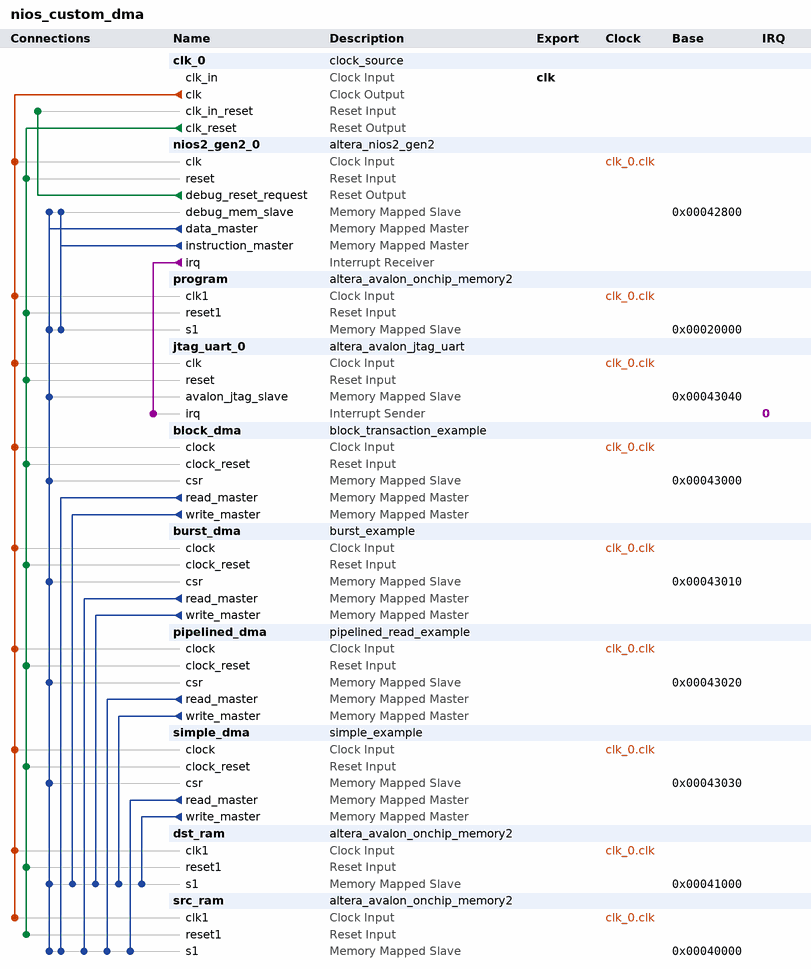
[diagram p0: system contents]
# Platform Designer (Qsys) system nios_custom_dma, MAX 10 10M50DAF484C6GES
# Parameters at their usual value, and those the tool derives, are not listed.
package require -exact qsys 22.1
create_system nios_custom_dma
set_project_property DEVICE_FAMILY {MAX 10}
set_project_property DEVICE 10M50DAF484C6GES

add_instance clk_0 clock_source 22.1
set_instance_parameter_value clk_0 clockFrequency 50000000

add_instance nios2_gen2_0 altera_nios2_gen2 22.1
set_instance_parameter_value nios2_gen2_0 dcache_size 2048
set_instance_parameter_value nios2_gen2_0 exceptionSlave program.s1
set_instance_parameter_value nios2_gen2_0 icache_size 4096
set_instance_parameter_value nios2_gen2_0 impl Fast
set_instance_parameter_value nios2_gen2_0 resetSlave program.s1

add_instance program altera_avalon_onchip_memory2 22.1
set_instance_parameter_value program dataWidth 32
set_instance_parameter_value program dualPort false
set_instance_parameter_value program initMemContent true
set_instance_parameter_value program initializationFileName onchip_mem.hex
set_instance_parameter_value program memorySize 81920

add_instance jtag_uart_0 altera_avalon_jtag_uart 22.1
set_instance_parameter_value jtag_uart_0 simInteractiveOptions NO_INTERACTIVE_WINDOWS

add_instance block_dma block_transaction_example 1.2

add_instance burst_dma burst_example 1.2

add_instance pipelined_dma pipelined_read_example 1.2

add_instance simple_dma simple_example 1.2

add_instance dst_ram altera_avalon_onchip_memory2 22.1
set_instance_parameter_value dst_ram dataWidth 32
set_instance_parameter_value dst_ram dualPort false
set_instance_parameter_value dst_ram initMemContent true
set_instance_parameter_value dst_ram initializationFileName onchip_mem.hex
set_instance_parameter_value dst_ram memorySize 4096

add_instance src_ram altera_avalon_onchip_memory2 22.1
set_instance_parameter_value src_ram dataWidth 32
set_instance_parameter_value src_ram dualPort false
set_instance_parameter_value src_ram initMemContent true
set_instance_parameter_value src_ram initializationFileName onchip_mem.hex
set_instance_parameter_value src_ram memorySize 4096

# connections
add_connection clk_0.clk block_dma.clock clock
add_connection clk_0.clk burst_dma.clock clock
add_connection clk_0.clk dst_ram.clk1 clock
add_connection clk_0.clk jtag_uart_0.clk clock
add_connection clk_0.clk nios2_gen2_0.clk clock
add_connection clk_0.clk pipelined_dma.clock clock
add_connection clk_0.clk program.clk1 clock
add_connection clk_0.clk simple_dma.clock clock
add_connection clk_0.clk src_ram.clk1 clock
add_connection clk_0.clk_reset block_dma.clock_reset reset
add_connection clk_0.clk_reset burst_dma.clock_reset reset
add_connection clk_0.clk_reset dst_ram.reset1 reset
add_connection clk_0.clk_reset jtag_uart_0.reset reset
add_connection clk_0.clk_reset nios2_gen2_0.reset reset
add_connection clk_0.clk_reset pipelined_dma.clock_reset reset
add_connection clk_0.clk_reset program.reset1 reset
add_connection clk_0.clk_reset simple_dma.clock_reset reset
add_connection clk_0.clk_reset src_ram.reset1 reset
add_connection nios2_gen2_0.debug_reset_request clk_0.clk_in_reset reset
add_connection block_dma.read_master src_ram.s1 avalon
set_connection_parameter_value block_dma.read_master/src_ram.s1 baseAddress 0x00040000
add_connection block_dma.write_master dst_ram.s1 avalon
set_connection_parameter_value block_dma.write_master/dst_ram.s1 baseAddress 0x00041000
add_connection burst_dma.read_master src_ram.s1 avalon
set_connection_parameter_value burst_dma.read_master/src_ram.s1 baseAddress 0x00040000
add_connection burst_dma.write_master dst_ram.s1 avalon
set_connection_parameter_value burst_dma.write_master/dst_ram.s1 baseAddress 0x00041000
add_connection nios2_gen2_0.data_master block_dma.csr avalon
set_connection_parameter_value nios2_gen2_0.data_master/block_dma.csr baseAddress 0x00043000
add_connection nios2_gen2_0.data_master burst_dma.csr avalon
set_connection_parameter_value nios2_gen2_0.data_master/burst_dma.csr baseAddress 0x00043010
add_connection nios2_gen2_0.data_master dst_ram.s1 avalon
set_connection_parameter_value nios2_gen2_0.data_master/dst_ram.s1 baseAddress 0x00041000
add_connection nios2_gen2_0.data_master jtag_uart_0.avalon_jtag_slave avalon
set_connection_parameter_value nios2_gen2_0.data_master/jtag_uart_0.avalon_jtag_slave baseAddress 0x00043040
add_connection nios2_gen2_0.data_master nios2_gen2_0.debug_mem_slave avalon
set_connection_parameter_value nios2_gen2_0.data_master/nios2_gen2_0.debug_mem_slave baseAddress 0x00042800
add_connection nios2_gen2_0.data_master pipelined_dma.csr avalon
set_connection_parameter_value nios2_gen2_0.data_master/pipelined_dma.csr baseAddress 0x00043020
add_connection nios2_gen2_0.data_master program.s1 avalon
set_connection_parameter_value nios2_gen2_0.data_master/program.s1 baseAddress 0x00020000
add_connection nios2_gen2_0.data_master simple_dma.csr avalon
set_connection_parameter_value nios2_gen2_0.data_master/simple_dma.csr baseAddress 0x00043030
add_connection nios2_gen2_0.data_master src_ram.s1 avalon
set_connection_parameter_value nios2_gen2_0.data_master/src_ram.s1 baseAddress 0x00040000
add_connection nios2_gen2_0.instruction_master nios2_gen2_0.debug_mem_slave avalon
set_connection_parameter_value nios2_gen2_0.instruction_master/nios2_gen2_0.debug_mem_slave baseAddress 0x00042800
add_connection nios2_gen2_0.instruction_master program.s1 avalon
set_connection_parameter_value nios2_gen2_0.instruction_master/program.s1 baseAddress 0x00020000
add_connection pipelined_dma.read_master src_ram.s1 avalon
set_connection_parameter_value pipelined_dma.read_master/src_ram.s1 baseAddress 0x00040000
add_connection pipelined_dma.write_master dst_ram.s1 avalon
set_connection_parameter_value pipelined_dma.write_master/dst_ram.s1 baseAddress 0x00041000
add_connection simple_dma.read_master src_ram.s1 avalon
set_connection_parameter_value simple_dma.read_master/src_ram.s1 baseAddress 0x00040000
add_connection simple_dma.write_master dst_ram.s1 avalon
set_connection_parameter_value simple_dma.write_master/dst_ram.s1 baseAddress 0x00041000
add_connection nios2_gen2_0.irq jtag_uart_0.irq interrupt
set_connection_parameter_value nios2_gen2_0.irq/jtag_uart_0.irq irqNumber 0

# exported interfaces
add_interface clk clock sink
set_interface_property clk EXPORT_OF clk_0.clk_in

set_interconnect_requirement {$system} qsys_mm.clockCrossingAdapter HANDSHAKE
set_interconnect_requirement {$system} qsys_mm.enableEccProtection FALSE
set_interconnect_requirement {$system} qsys_mm.insertDefaultSlave FALSE
set_interconnect_requirement {$system} qsys_mm.maxAdditionalLatency 1

save_system nios_custom_dma.qsys
